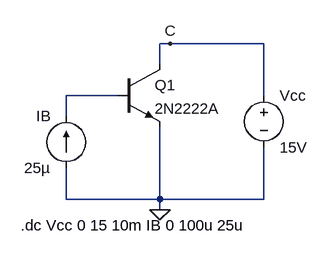
[diagram p0: schematic E6-curvas-2N2222.asc]
E6-curvas-2N2222.asc, the LTspice schematic file:
Version 4
SHEET 1 880 680
WIRE 256 96 240 96
WIRE 400 96 256 96
WIRE 240 128 240 96
WIRE 176 176 96 176
WIRE 400 176 400 96
WIRE 96 208 96 176
WIRE 96 336 96 288
WIRE 240 336 240 224
WIRE 240 336 96 336
WIRE 400 336 400 256
WIRE 400 336 240 336
WIRE 240 352 240 336
FLAG 240 352 0
FLAG 256 96 C
SYMBOL npn 176 128 R0
SYMATTR InstName Q1
SYMATTR Value 2N2222A
SYMBOL voltage 400 160 R0
SYMATTR InstName Vcc
SYMATTR Value 15V
SYMBOL current 96 288 R180
WINDOW 0 24 80 Left 2
WINDOW 3 24 0 Left 2
SYMATTR InstName IB
SYMATTR Value 25µ
TEXT 26 376 Left 2 !.dc Vcc 0 15 10m IB 0 100u 25u

The netlist it stands for:
* E6-curvas-2N2222.asc
Q1 C N001 0 0 2N2222A
Vcc C 0 15V
IB 0 N001 25µ
.model NPN NPN
.model PNP PNP
.lib standard.bjt
.dc Vcc 0 15 10m IB 0 100u 25u
.backanno
.end